# Altium schematic sheet 07_WiFi-BLE.SchDoc
size A4; CompanyName: Microchip Technology Inc.; Organization: Microchip Technology; Address1: 2355 West Chandler Blvd.; Address2: Chandler, AZ  85224; Address4: USA; SheetNumber: 5; SheetTotal: 6; SheetTitle: WiFi/BLE/FLASH; Time: Time
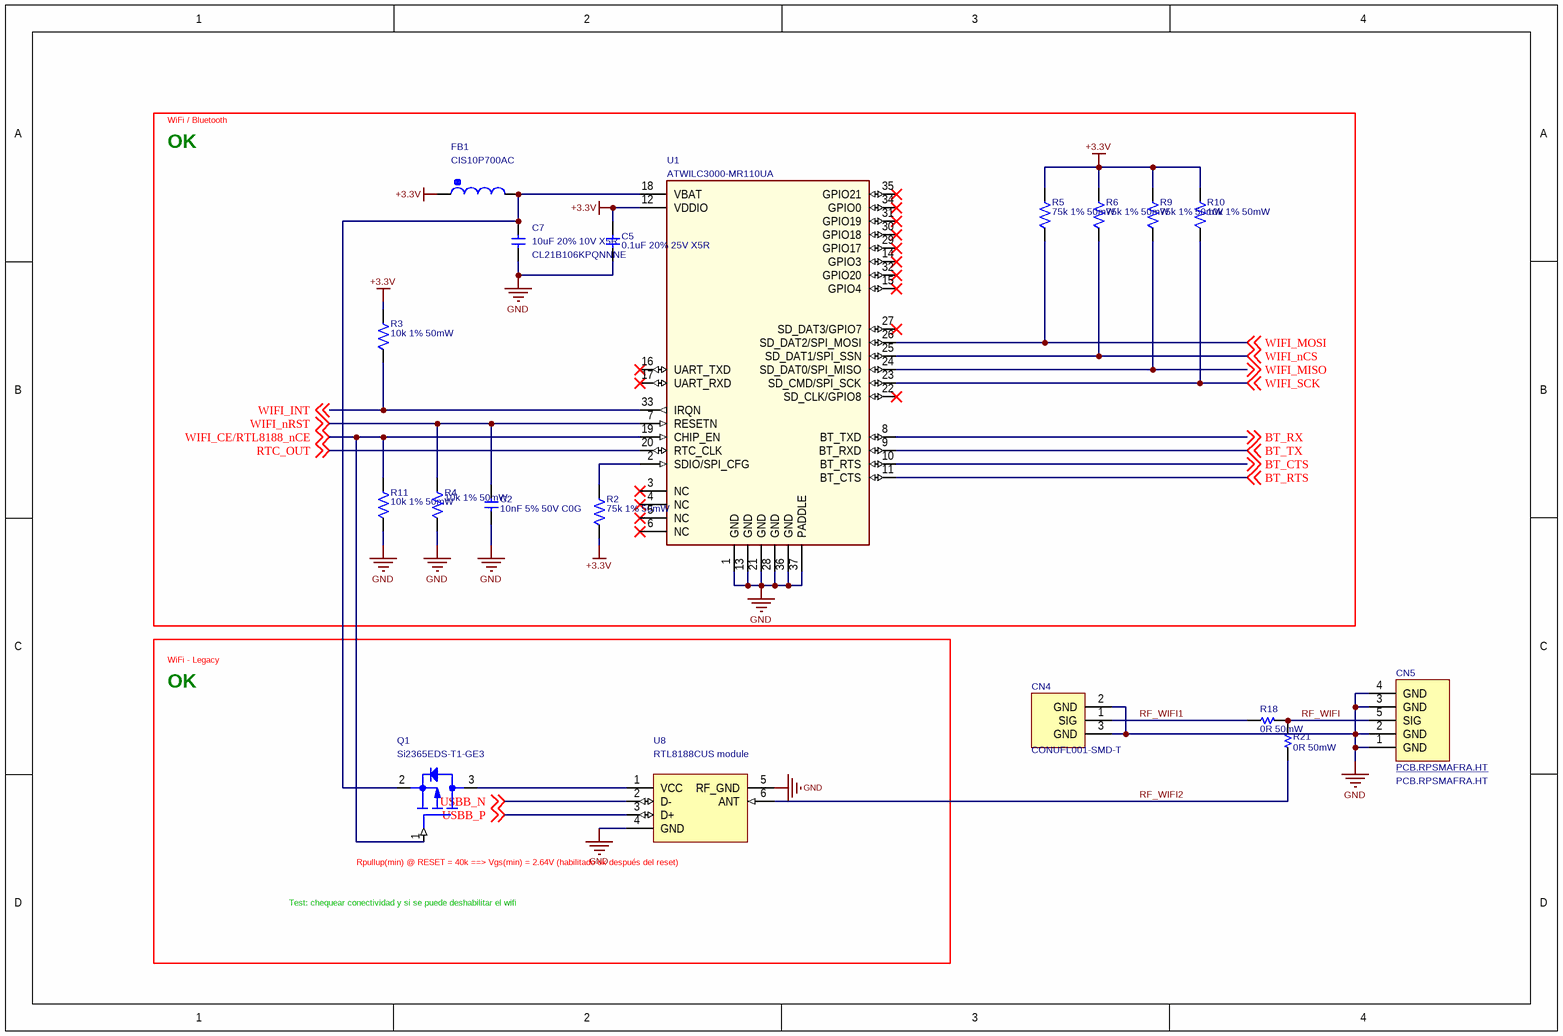
[diagram p0: 07_WiFi-BLE.SchDoc]

## Parts
C2  10nF 5% 50V C0G  [CAPC1005N]
C5  0.1uF 20% 25V X5R  [CAPC1005N]
C7  10uF 20% 10V X5R  MFG_PN: CL21B106KPQNNNE  [CAPC2012X140N]
CN4  CONUFL001-SMD-T  [U.FL-R-SMT-1]
CN5  PCB.RPSMAFRA.HT  [0733910320]
FB1  CIS10P700AC  [INDC1608X95N]
Q1  Si2365EDS-T1-GE3  [SOT95P230X110-3N]
R2  75k 1% 50mW  [RESC1005X40N]
R3  10k 1% 50mW  [RESC1005X40N]
R4  10k 1% 50mW  [RESC1005X40N]
R5  75k 1% 50mW  [RESC1005X40N]
R6  75k 1% 50mW  [RESC1005X40N]
R9  75k 1% 50mW  [RESC1005X40N]
R10  10k 1% 50mW  [RESC1005X40N]
R11  10k 1% 50mW  [RESC1005X40N]
R18  0R 50mW  [RESC1005X40N]
R21  0R 50mW  [RESC1005X40N]
U1  ATWILC3000-MR110UA  [ATWILC3000-MR110CA]
U8  RTL8188CUS module  [GWF-7M01]

## Blocks framed on the sheet
OK: C2 C5 C7 FB1 R2-R6 R9-R11 U1
OK: Q1 U8

## Nets
+3.3V: C5.2 FB1.1 R2.2 R3.1 R5.1 R6.1 R9.1 R10.1 U1.12(VDDIO)
GND: C2.2 C5.1 C7.2 CN4.2(GND) CN4.3(GND) CN5.1(GND) CN5.2(GND) CN5.3(GND) CN5.4(GND) R4.2 R11.2 U1.1(GND) U1.13(GND) U1.21(GND) U1.28(GND) U1.36(GND) U1.37(PADDLE) U8.4(GND) U8.5(RF_GND)
BT_CTS: U1.10(BT_RTS) ; off-sheet BT_CTS
BT_RTS: U1.11(BT_CTS) ; off-sheet BT_RTS
BT_RX: U1.8(BT_TXD) ; off-sheet BT_RX
BT_TX: U1.9(BT_RXD) ; off-sheet BT_TX
RF_WIFI: CN5.5(SIG) R18.2 R21.2
RF_WIFI1: CN4.1(SIG) R18.1
RF_WIFI2: R21.1 U8.6(ANT)
RTC_OUT: U1.20(RTC_CLK) ; off-sheet RTC_OUT
USBB_N: U8.2(D-) ; off-sheet USBB_N
USBB_P: U8.3(D+) ; off-sheet USBB_P
WIFI_CE/RTL8188_nCE: Q1.1(GATE) R11.1 U1.19(CHIP_EN) ; off-sheet WIFI_CE/RTL8188_nCE
WIFI_INT: R3.2 U1.33(IRQN) ; off-sheet WIFI_INT
WIFI_MISO: R9.2 U1.24(SD_DAT0/SPI_MISO) ; off-sheet WIFI_MISO
WIFI_MOSI: R5.2 U1.26(SD_DAT2/SPI_MOSI) ; off-sheet WIFI_MOSI
WIFI_nCS: R6.2 U1.25(SD_DAT1/SPI_SSN) ; off-sheet WIFI_nCS
WIFI_nRST: C2.1 R4.1 U1.7(RESETN) ; off-sheet WIFI_nRST
WIFI_SCK: R10.2 U1.23(SD_CMD/SPI_SCK) ; off-sheet WIFI_SCK
NetC7_1: C7.1 FB1.2 Q1.2(SOURCE) U1.18(VBAT)
NetQ1_3: Q1.3(DRAIN) U8.1(VCC)
NetR2_1: R2.1 U1.2(SDIO/SPI_CFG)

Not connected (* = marked no-connect by the designer): U1 3(NC)* 4(NC)* 5(NC)* 6(NC)* 14(GPIO3)* 15(GPIO4)* 16(UART_TXD)* 17(UART_RXD)* 22(SD_CLK/GPIO8)* 27(SD_DAT3/GPIO7)* 29(GPIO17)* 30(GPIO18)* 31(GPIO19)* 32(GPIO20)* 34(GPIO0)* 35(GPIO21)*

## Notes on the sheet
- WiFi / Bluetooth
- WiFi - Legacy
- Test: chequear conectividad y si se puede deshabilitar el wifi
- Rpullup(min) @ RESET = 40k ==> Vgs(min) = 2.64V (habilitado ok después del reset)

## Library data of the parts
C2 = C: Capacitor, Ceramic; MFG: <GENERIC>; Symbol Checked: Ok; FP_DESC: C0402; Replacement Allowed: Yes; Footprint Checked: Assign OK, Footprint OK; MFG_PN: <GENERIC>; Value: 10nF; TOLERANCE: 5%; VOLTAGE: 50V; TECHNOLOGY: C0G
C5 = C_Dup1: Capacitor, Ceramic; FP_DESC: C0402; MFG_PN: CL05A104KA5NNNC; MFG: SAMSUNG; Symbol Checked: Ok; Replacement Allowed: Ask; Footprint Checked: Assign OK, Footprint OK; TECHNOLOGY: X5R; TOLERANCE: 20%; VALUE: 0.1uF; VOLTAGE: 25V
C7 = C_Dup1: Capacitor, Ceramic; MFG: SAMSUNG; FP_DESC: C0805; Symbol Checked: Ok; Replacement Allowed: Ask; Footprint Checked: Assign OK, Footprint OK; TECHNOLOGY: X5R; TOLERANCE: 20%; VALUE: 10uF; VOLTAGE: 10V
CN4 = U.FL-R-SMT-1: Ultra Small Surface Mount Coaxial Connectors - 1.9mm or 2.4mm Mated Height; MFG: LINX; FP_DESC: U.FL connector; Symbol Checked: Ok; Replacement Allowed: Ask; MFG_PN: CONUFL001-SMD-T; Footprint Checked: Assign OK, Footprint OK
CN5 = RPSMA: RP-SMA, Right angle; MFG: TAOGLAS; Symbol Checked: Ok; Replacement Allowed: Ask; FP_DESC: RP-SMA, Right angle; MFG_PN: PCB.RPSMAFRA.HT; Footprint Checked: Assign Ok, Footprint Ok
FB1 = L: Ferrite Bead; MFG: SAMSUNG; FP_DESC: L0603; Symbol Checked: Ok; Replacement Allowed: No; MFG_PN: CIS10P700AC; Footprint Checked: Assign OK, Footprint OK
Q1 = DMG1013UW: MOSFET, P channel; MFG: VISHAY; FP_DESC: SOT23-3; Symbol Checked: Ok; Replacement Allowed: No; MFG_PN: Si2365EDS-T1-GE3; Footprint Checked: Assign OK, Footprint OK
R2-R6 R9-R11 = R: Resistor, SMD; FP_DESC: R0402; MFG_PN: <GENERIC>; Symbol Checked: Ok; Replacement Allowed: Yes; MFG: <GENERIC>; Footprint Checked: Assign OK, Footprint OK; POWER: 50mW; TOLERANCE: 1%
  R2 R5 R6 R9: VALUE: 75k
  R3 R4 R10 R11: VALUE: 10k
R18 R21 = R: Resistor, SMD; MFG: <GENERIC>; Symbol Checked: Ok; FP_DESC: R0402; Replacement Allowed: Yes; Footprint Checked: Assign OK, Footprint OK; MFG_PN: <GENERIC>; Value: 0R; POWER: 50mW
U1 = MIC8126: IEEE 802.11 b/g/n Link Controller Module with Integrated Bluetooth 4.0; FP_DESC: ATWILC3000-MR110CA Module; MFG: MICROCHIP; Symbol Checked: Ok; Replacement Allowed: No; Footprint Checked: Assign OK, Footprint OK; MFG_PN: ATWILC3000-MR110UA
U8 = GWF-7M01: 150Mbps IEEE 802.11 b/g/n WiFi Module; MFG: FORMIKE; Symbol Checked: Ok; Replacement Allowed: Ask; FP_DESC: RTL8188CUS module; MFG_PN: RTL8188CUS module; Footprint Checked: Assign OK, Footprint OK